# Altium schematic sheet MCU.SchDoc: Science - 2_MCU
size Letter; DrawnBy: Christopher Arjune; Organization: UW Robotics; Address1: 200 University Avenue; Address2: Waterloo; Address3: Ontario; Address4: Canada N2L 3G6; SheetNumber: 2; SheetTotal: 6
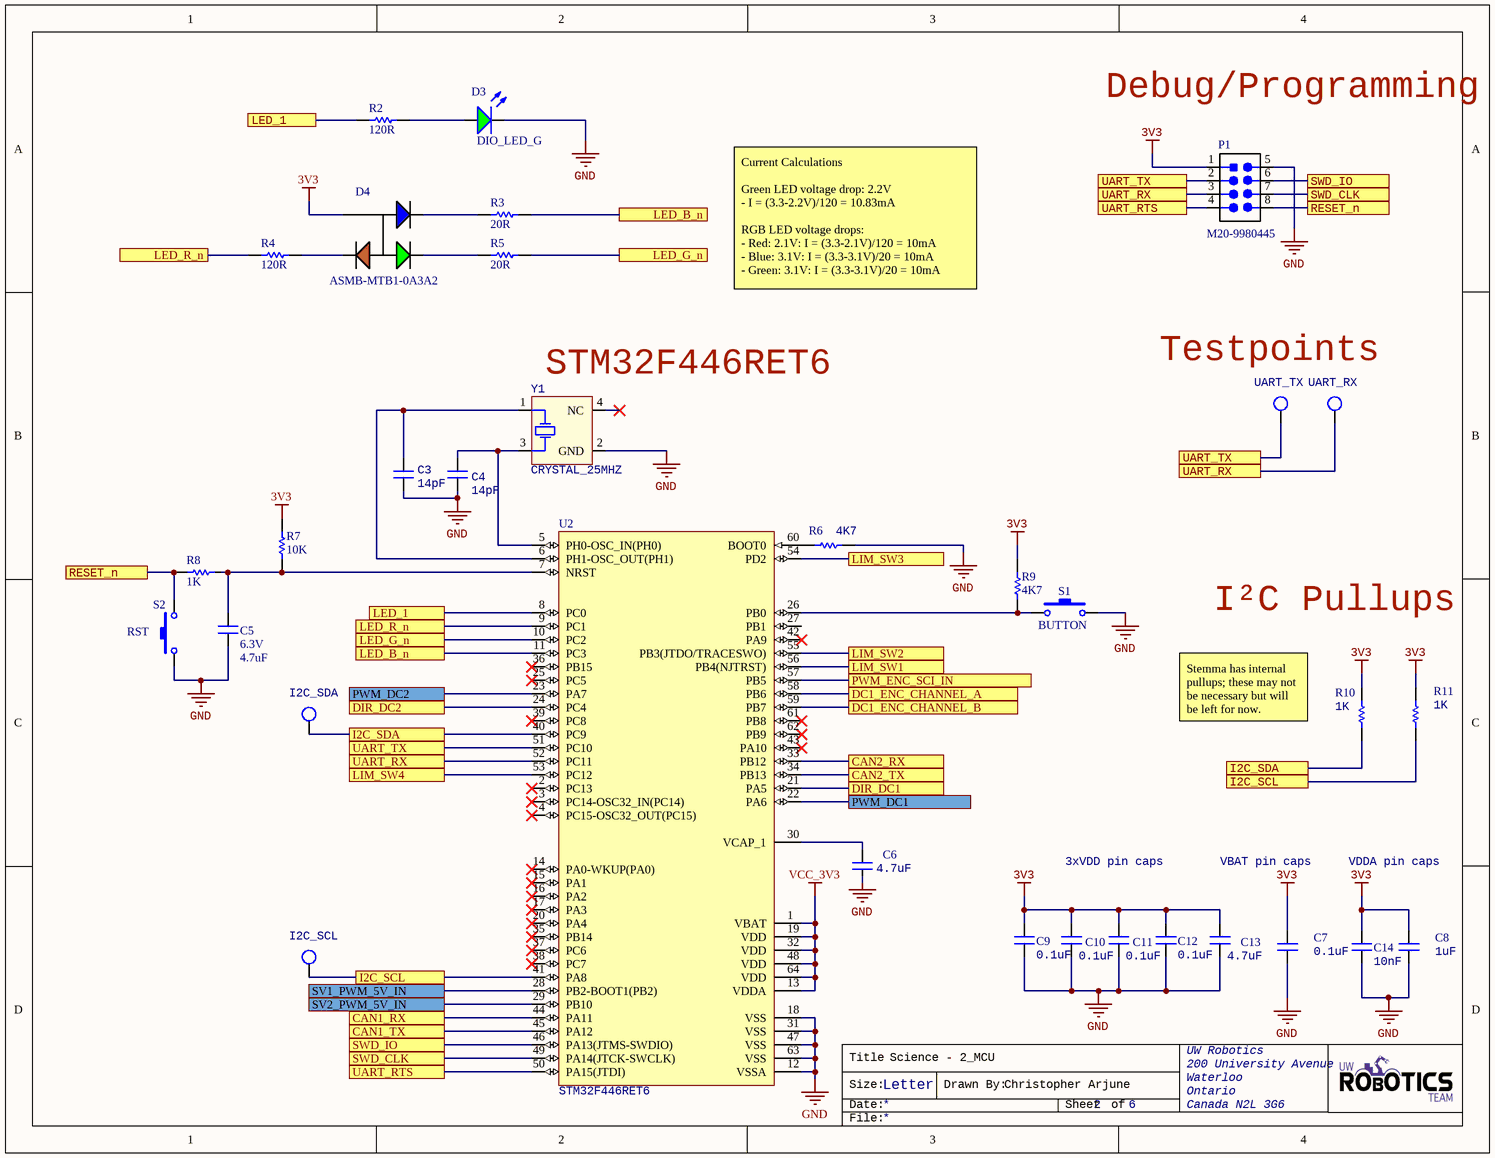
[diagram p0: MCU.SchDoc]

## Parts
C3  value 14pF  (hidden comment: CAP_14pF_50V_0603)
C4  value 14pF  (hidden comment: CAP_14pF_50V_0603)
C5  value 4.7uF  Voltage Rating: 6.3V  [CAPC0603(1608)55_N]  (hidden comment: CAP_4.7uF_0603)
C6  value 4.7uF  [CAPC0603(1608)55_N]  (hidden comment: CAP_4.7uF_0603)
C7  value 0.1uF  [CAPC0603(1608)55_N]  (hidden comment: CAP_0.1uF_16V_0603)
C8  value 1uF  [CAPC0603(1608)55_N]  (hidden comment: CAP_1uF_16V_0603)
C9  value 0.1uF  [CAPC0603(1608)55_N]  (hidden comment: CAP_0.1uF_16V_0603)
C10  value 0.1uF  [CAPC0603(1608)55_N]  (hidden comment: CAP_0.1uF_16V_0603)
C11  value 0.1uF  [CAPC0603(1608)55_N]  (hidden comment: CAP_0.1uF_16V_0603)
C12  value 0.1uF  [CAPC0603(1608)55_N]  (hidden comment: CAP_0.1uF_16V_0603)
C13  value 4.7uF  [CAPC0603(1608)55_N]  (hidden comment: CAP_4.7uF_0603)
C14  value 10nF  [CAPC0603(1608)55_N]  (hidden comment: CAP_10nF_0603)
D3  DIO_LED_G  [LED_0805_LINE]
D4  Manufacturer Part Number 1: ASMB-MTB1-0A3A2  [LED_RGB]  (hidden comment: LED_RGB)
I2C_SCL  TESTPOINT_LOOP  [TESTPOINT_LOOP]  (value not drawn)
I2C_SDA  TESTPOINT_LOOP  [TESTPOINT_LOOP]  (value not drawn)
P1  Manufacturer Part Number 1: M20-9980445  [HEADER_2X4]  (hidden comment: HEADER 4X2)
R2  value 120R  [RESC0603(1608)_N]  (hidden comment: RES_120R_0603)
R3  value 20R  [RESC0603(1608)_N]  (hidden comment: RES_20R_0603)
R4  value 120R  [RESC0603(1608)_N]  (hidden comment: RES_120R_0603)
R5  value 20R  [RESC0603(1608)_N]  (hidden comment: RES_20R_0603)
R6  value 4K7  [RESC0603(1608)_N]  (hidden comment: RES_4K7_0603)
R7  value 10K  [RESC0603(1608)_N]  (hidden comment: RES_10K_0603)
R8  value 1K  [RESC0603(1608)_N]  (hidden comment: RES_1K_0603)
R9  value 4K7  [RESC0603(1608)_N]  (hidden comment: RES_4K7_0603)
R10  value 1K  [RESC0603(1608)_N]  (hidden comment: RES_4K7_0603)
R11  value 1K  [RESC0603(1608)_N]  (hidden comment: RES_4K7_0603)
S1  BUTTON  [B3U-1100P]
S2  RST  [PTS830GM140]
U2  STM32F446RET6  [STM-LQFP64_L]
UART_RX  TESTPOINT_LOOP  [TESTPOINT_LOOP]  (value not drawn)
UART_TX  TESTPOINT_LOOP  [TESTPOINT_LOOP]  (value not drawn)
Y1  CRYSTAL_25MHZ

## Ports
CAN1_RX, CAN1_TX, CAN2_RX, CAN2_TX, DC1_ENC_CHANNEL_A, DC1_ENC_CHANNEL_B, DIR_DC1, DIR_DC2, I2C_SCL, I2C_SDA, LED_1, LED_B_n, LED_G_n, LED_R_n, LIM_SW1, LIM_SW2, LIM_SW3, LIM_SW4, PWM_DC1, PWM_DC2, PWM_ENC_SCI_IN, RESET_n, SV1_PWM_5V_IN, SV2_PWM_5V_IN, SWD_CLK, SWD_IO, UART_RTS, UART_RX, UART_TX

## Nets
3V3: C7.2 C8.2 C9.2 C10.2 C11.2 C12.2 C13.2 C14.2 D4.4 P1.1(VCC) R7.2 R9.1 R10.2 R11.2
GND: C3.1 C4.1 C5.2 C6.1 C7.1 C8.1 C9.1 C10.1 C11.1 C12.1 C13.1 C14.1 D3.2(K) P1.5(GND) R6.1 S1.2 S2.1 U2.12(VSSA) U2.18(VSS) U2.31(VSS) U2.47(VSS) U2.63(VSS) Y1.2(GND)
VCC_3V3: U2.1(VBAT) U2.13(VDDA) U2.19(VDD) U2.32(VDD) U2.48(VDD) U2.64(VDD)
CAN1_RX: U2.44(PA11) ; port CAN1_RX
CAN1_TX: U2.45(PA12) ; port CAN1_TX
CAN2_RX: U2.33(PB12) ; port CAN2_RX
CAN2_TX: U2.34(PB13) ; port CAN2_TX
DC1_ENC_CHANNEL_A: U2.58(PB6) ; port DC1_ENC_CHANNEL_A
DC1_ENC_CHANNEL_B: U2.59(PB7) ; port DC1_ENC_CHANNEL_B
DIR_DC1: U2.21(PA5) ; port DIR_DC1
DIR_DC2: U2.24(PC4) ; port DIR_DC2
I2C_SCL: I2C_SCL.1 R11.1 U2.41(PA8) ; port I2C_SCL
I2C_SDA: I2C_SDA.1 R10.1 U2.40(PC9) ; port I2C_SDA
LED_1: R2.1 U2.8(PC0) ; port LED_1
LED_B_n: R3.2 U2.11(PC3) ; port LED_B_n
LED_G_n: R5.2 U2.10(PC2) ; port LED_G_n
LED_R_n: R4.1 U2.9(PC1) ; port LED_R_n
LIM_SW1: U2.56(PB4(NJTRST)) ; port LIM_SW1
LIM_SW2: U2.55(PB3(JTDO/TRACESWO)) ; port LIM_SW2
LIM_SW3: U2.54(PD2) ; port LIM_SW3
LIM_SW4: U2.53(PC12) ; port LIM_SW4
PWM_DC1: U2.22(PA6) ; port PWM_DC1
PWM_DC2: U2.23(PA7) ; port PWM_DC2
PWM_ENC_SCI_IN: U2.57(PB5) ; port PWM_ENC_SCI_IN
RESET_n: P1.8 R8.1 S2.2 ; port RESET_n
SV1_PWM_5V_IN: U2.28(PB2-BOOT1(PB2)) ; port SV1_PWM_5V_IN
SV2_PWM_5V_IN: U2.29(PB10) ; port SV2_PWM_5V_IN
SWD_CLK: P1.7 U2.49(PA14(JTCK-SWCLK)) ; port SWD_CLK
SWD_IO: P1.6 U2.46(PA13(JTMS-SWDIO)) ; port SWD_IO
UART_RTS: P1.4 U2.50(PA15(JTDI)) ; port UART_RTS
UART_RX: P1.3 U2.52(PC11) UART_RX.1 ; port UART_RX
UART_TX: P1.2 U2.51(PC10) UART_TX.1 ; port UART_TX
NetC3_2: C3.2 U2.6(PH1-OSC_OUT(PH1)) Y1.1(HOT)
NetC4_2: C4.2 U2.5(PH0-OSC_IN(PH0)) Y1.3(HOT)
NetC5_1: C5.1 R7.1 R8.2 U2.7(NRST)
NetC6_2: C6.2 U2.30(VCAP_1)
NetD3_1: D3.1(A) R2.2
NetD4_1: D4.1 R4.2
NetD4_2: D4.2 R5.1
NetD4_3: D4.3 R3.1
NetR6_2: R6.2 U2.60(BOOT0)
NetR9_2: R9.2 S1.1 U2.26(PB0)

Not connected (* = marked no-connect by the designer): U2 2(PC13)* 3(PC14-OSC32_IN(PC14))* 4(PC15-OSC32_OUT(PC15))* 14(PA0-WKUP(PA0))* 15(PA1)* 16(PA2)* 17(PA3)* 20(PA4)* 25(PC5)* 27(PB1) 35(PB14)* 36(PB15)* 37(PC6)* 38(PC7)* 39(PC8)* 42(PA9)* 43(PA10)* 61(PB8)* 62(PB9)*; Y1 4(NC)*

## Notes on the sheet
- Debug/Programming
- Current Calculations
  Green LED voltage drop: 2.2V
  - I = (3.3-2.2V)/120 = 10.83mA
  RGB LED voltage drops:
  - Red: 2.1V: I = (3.3-2.1V)/120 = 10mA
  - Blue: 3.1V: I = (3.3-3.1V)/20 = 10mA
  - Green: 3.1V: I = (3.3-3.1V)/20 = 10mA
- Testpoints
- (near Y1) STM32F446RET6
- I²C Pullups
- Stemma has internal pullups; these may not be necessary but will be left for now.
- 3xVDD pin caps
- VBAT pin caps
- VDDA pin caps
- Title
- Size:
- Date:
- Letter
- Drawn By:
- Sheet
- of
- File:

## Library data of the parts
C3 C4 = CAP_14pF_50V_0603: CAP CER 14PF 50V C0G/NP0 0603; Manufacturer 1: Samsung; Manufacturer Part Number 1: CL10C140JB8NNNC; Tolerance: 5%; Dielectric: C0G; Voltage Rating: 50V; Supplier Part Number 1: 1276-2187-1-ND; Supplier 1: Digi-Key; Stock 1: 187088; Pricing 1: 1=0.10000, 10=0.06700, 100=0.02980, 500=0.02130, 1000=0.01673 (USD); RoHS: Yes; Mount: Surface Mount; Case/Package: 0603; Case Code (Metric): 1608; Case Code (Imperial): 0603; Min Operating Temperature: -55°C; Max Operating Temperature: 125°C; Package Quantity: 1; Packaging: Tape and Reel; Voltage Rating (DC): 50V; Length: 1.6mm; Height: 0.8mm; Width: 0.031inch; Depth: 0.8mm; Thickness: 0.035inch; Radiation Hardening: No; ComponentLink1URL: https://datasheet.ciiva.com/25782/cl10c140jb8nnnc-25782947.pdf?src-supplier=Digi-Key; ComponentLink1Description: https://datasheet.ciiva.com/25782/cl10c140jb8nnnc-25782947.pdf?src-supplier=Digi-Key; Capacitance: 14pF
C5 = CAP_4.7uF_0603: CAP CER 4.7UF 6.3V X5R 0603; Manufacturer Part Number 1: CC0603KRX5R5BB475; Manufacturer 1: Yageo; Dimensions: 0.063" L x 0.031" W (1.60mm x 0.80mm); Package: 0603 (1608 Metric); Temperature Coefficient: X5R; Supplier Part Number 1: 311-1521-1-ND; Supplier 1: Digi-Key; Mount: Surface Mount
C6 C13 = CAP_4.7uF_0603: CAP CER 4.7UF 6.3V X5R 0603; Manufacturer: Yageo; MPN: CC0603KRX5R5BB475; Dimensions: 0.063" L x 0.031" W (1.60mm x 0.80mm); Package: 0603 (1608 Metric); Temperature Coefficient: X5R; Voltage Rating: 6.3V; Supplier Part Number 1: 311-1521-1-ND; Supplier 1: Digi-Key
C7 C9-C12 = CAP_0.1uF_16V_0603: CAP CER 0.1UF 16V X7R 0603; Manufacturer: Yageo; MPN: CC0603KRX7R7BB104; Dimensions: 0.063" L x 0.031" W (1.60mm x 0.80mm); Package: 0603 (1608 Metric); Temperature Coefficient: X7R; Voltage Rating: 16V; Supplier Part Number 1: 311-1088-1-ND; Supplier 1: Digi-Key
C8 = CAP_1uF_16V_0603: CAP CER 1UF 16V Y5V 0603; Manufacturer: Yageo; MPN: CC0603ZRY5V7BB105; Dimensions: 0.063" L x 0.031" W (1.60mm x 0.80mm); Package: 0603 (1608 Metric); Temperature Coefficient: Y5V; Voltage Rating: 16V; Supplier Part Number 1: 311-1372-1-ND; Supplier 1: Digi-Key
C14 = CAP_10nF_0603: CAP CER 10000PF 16V X7R 0603; Manufacturer: Yageo; MPN: CC0603KRX7R7BB103; Dimensions: 0.063" L x 0.031" W (1.60mm x 0.80mm); Package: 0603 (1608 Metric); Temperature Coefficient: X7R; Voltage Rating: 16V; Supplier Part Number 1: 311-3369-1-ND; Supplier 1: Digi-Key
D3 = DIO_LED_G: LED GREEN DIFFUSED 0805 SMD; Manufacturer: OSRAM; MPN: LG R971-KN-1; Forward Voltage Drop: 2.2V; Package: 0805 (2012 Metric); Supplier Part Number 1: 475-1410-1-ND; Supplier 1: Digi-Key
D4 = LED_RGB: LED RGB DIFFUSED 4PLCC SMD; Manufacturer 1: Broadcom; Color: Blue,Green,Red; Lens Color: White; Viewing Angle: 115°; Lens Style: Round; Luminous Intensity: 350mcd; Dominant Wavelength: 470nm; Forward Voltage: 3.1V; Test Current: 20mA; Supplier 1: Digi-Key; Stock 1: 142531; Pricing 1: 1=0.60000, 10=0.47100, 100=0.30210, 500=0.25980, 1000=0.20059 (USD); RoHS: Yes; Mount: Surface Mount; Case/Package: PLCC; Number of Pins: 4; Packaging: Cut Tape; Lens Transparency: Diffused; Length: 3.2mm; Height: 1.9mm; Width: 2.8mm; REACH SVHC: No SVHC; ComponentLink1URL: http://www.farnell.com/datasheets/2111106.pdf?src-supplier=Farnell; ComponentLink1Description: http://www.farnell.com/datasheets/2111106.pdf?src-supplier=Farnell; ComponentLink2URL: https://docs.broadcom.com/docs/AV02-4194EN?src-supplier=Digi-Key; ComponentLink2Description: https://docs.broadcom.com/docs/AV02-4194EN?src-supplier=Digi-Key; ComponentLink3URL: http://www.farnell.com/datasheets/1801564.pdf?src-supplier=Element14; ComponentLink3Description: http://www.farnell.com/datasheets/1801564.pdf?src-supplier=Element14; ComponentLink4URL: http://www.farnell.com/datasheets/2111106.pdf?src-supplier=Newark; ComponentLink4Description: http://www.farnell.com/datasheets/2111106.pdf?src-supplier=Newark; Supplier Part Number 1: 516-3280-1-ND
I2C_SCL I2C_SDA UART_RX UART_TX = TESTPOINT_LOOP: Loop testpoint through-hole pad; Manufacturer: Keystone Electronics; Manufacturer Part Number 1: 5002; Supplier Part Number 1: 36-5002-ND; Supplier 1: Digi-Key
P1 = HEADER 4X2: CONN HEADER VERT 8POS 2.54MM; Manufacturer 1: Harwin Inc.; Supplier Part Number 1: 952-2122-ND; Supplier 1: Digi-Key
R2 R4 = RES_120R_0603: RES SMD 120 OHM 5% 1/10W 0603; Manufacturer: Yageo; MPN: RC0603JR-07120RL; Package: 0603 (1608 Metric); Dimensions: 0.063" L x 0.031" W (1.60mm x 0.80mm); Tolerance: 5%; Supplier Part Number 1: 311-120GRCT-ND; Supplier 1: Digi-Key
R3 R5 = RES_20R_0603: RES SMD 20 OHM 5% 1/10W 0603; Manufacturer: Yageo; MPN: RC0603JR-0720RL; Package: 0603 (1608 Metric); Dimensions: 0.063" L x 0.031" W (1.60mm x 0.80mm); Tolerance: 5%; Supplier Part Number 1: 311-20GRCT-ND; Supplier 1: Digi-Key
R6 R9-R11 = RES_4K7_0603: RES SMD 4.7K OHM 5% 1/10W 0603; Manufacturer: Yageo; MPN: RC0603JR-074K7L; Package: 0603 (1608 Metric); Dimensions: 0.063" L x 0.031" W (1.60mm x 0.80mm); Tolerance: 5%; Supplier Part Number 1: 311-4.7KGRCT-ND; Supplier 1: Digi-Key
R7 = RES_10K_0603: RES SMD 10K OHM 5% 1/10W 0603; Manufacturer 1: Yageo; Manufacturer Part Number 1: RC0603JR-0710KL; Package: 0603 (1608 Metric); Dimensions: 0.063" L x 0.031" W (1.60mm x 0.80mm); Tolerance: 5%; Supplier Part Number 1: 311-10KGRCT-ND; Supplier 1: Digi-Key; Mount: Surface Mount
R8 = RES_1K_0603: RES SMD 1K OHM 5% 1/10W 0603; Manufacturer 1: Yageo; Manufacturer Part Number 1: RC0603JR-071KL; Dimensions: 0.063" L x 0.031" W (1.60mm x 0.80mm); Tolerance: 5%; Package: 0603 (1608 Metric); Supplier Part Number 1: 311-1.0KGRCT-ND; Supplier 1: Digi-Key; Mount: Surface Mount
S1 = SW_TACTILE: Tactile Switch (Grey); Manufacturer: Omron Electronics Inc-EMC Div; MPN: B3U-1100P; Supplier Part Number 1: SW1021CT-ND; Supplier 1: Digi-Key
S2 = SW_PWR: Power Switch (Red); pin to pad: 2>4; MPN: PTS830GM140 SMTR LFS; Manufacturer: C&K; ComponentLink1Description: Datasheet; ComponentLink1URL: https://www.ckswitches.com/media/1478/pts830.pdf; Supplier Part Number 1: CKN10587CT-ND; Supplier 1: Digi-Key
U2 = MCU_STM32F446RET6: ARM Cortex-M4 32-bit MCU+FPU, 512 KB Flash, 128 KB Internal RAM, 50 I/Os, 64-Pin LQFP, -40 to 85 degC, Tray; I/Os (High Current): 50; Supply Voltage(Vcc) min (V): 1.7; Operating Frequency(F) (Processor speed) (MHz): 180; D/A Converter: 2; Internal RAM Size (kB): 128; FLASH Size (Prog) (kB): 512; Core: ARM Cortex-M4; ComponentLink1Description: Manufacturer URL; Package Reference: 64-Pin Low-profile Quad Flat Package, Body 10 x 10 mm, Pitch 0.5 mm; ComponentLink2URL: http://www.st.com/st-web-ui/static/active/en/resource/technical/document/datasheet/DM00141306.pdf; Packing: Tray; DatasheetVersion: Rev. 6; ComponentLink1URL: http://www.st.com/; ComponentLink2Description: Datasheet; Package Description: LQFP64; Mounting Technology: Surface Mount; Supplier 1: Digi-Key; Supplier Part Number 1: 497-15376-ND
Y1 = CRYSTAL_25MHZ: CRYSTAL 25.0000MHZ 12PF SMD; Manufacturer 1: Kyocera AVX; Manufacturer Part Number 1: CX2520DB25000H0FLJC1; Frequency: 25MHz; ESR (Equivalent Series Resistance): 80R; Frequency Stability: 15ppm; Frequency Tolerance: 10ppm; ComponentLink1Description: https://media.digikey.com/pdf/Data%20Sheets/AVX%20PDFs/CX2520DB_USY1M-H1-16429-00_Spec.pdf?src-supplier=Digi-Key; ComponentLink1URL: https://media.digikey.com/pdf/Data%20Sheets/AVX%20PDFs/CX2520DB_USY1M-H1-16429-00_Spec.pdf?src-supplier=Digi-Key; Supplier 1: Digi-Key; Supplier Part Number 1: 1253-1724-1-ND; Stock 1: 11741; Pricing 1: 1=0.72000, 10=0.63300, 50=0.59120, 100=0.52250, 500=0.49500, 1000=0.41250 (USD); RoHS: Yes; Mount: Surface Mount; Case/Package: SMD/SMT; Min Operating Temperature: -30°C; Max Operating Temperature: 85°C; Packaging: Tape and Reel; Load Capacitance: 12pF; Length: 0.098inch; Height: 0.022inch; Width: 0.079inch; Ratings: AEC-Q200